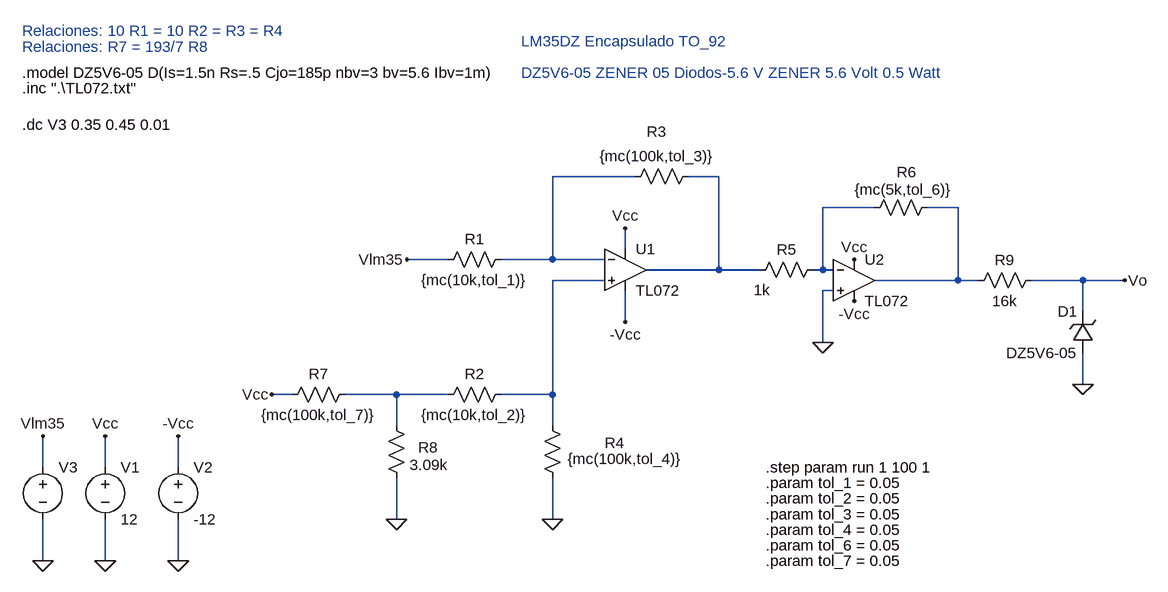
[diagram p0: schematic Modelo-2.asc]
Modelo-2.asc, the LTspice schematic file:
Version 4
SHEET 1 2448 680
WIRE 496 -208 368 -208
WIRE 624 -208 576 -208
WIRE 864 -160 784 -160
WIRE 992 -160 944 -160
WIRE 480 -96 480 -128
WIRE 208 -80 144 -80
WIRE 368 -80 368 -208
WIRE 368 -80 288 -80
WIRE 448 -80 368 -80
WIRE 624 -64 624 -208
WIRE 624 -64 512 -64
WIRE 688 -64 624 -64
WIRE 784 -64 784 -160
WIRE 784 -64 768 -64
WIRE 800 -64 784 -64
WIRE 448 -48 368 -48
WIRE 992 -48 992 -160
WIRE 992 -48 864 -48
WIRE 1024 -48 992 -48
WIRE 1184 -48 1104 -48
WIRE 1248 -48 1184 -48
WIRE 800 -32 784 -32
WIRE 1184 0 1184 -48
WIRE 480 16 480 -32
WIRE 784 48 784 -32
WIRE 1184 112 1184 64
WIRE -32 128 -64 128
WIRE 128 128 48 128
WIRE 208 128 128 128
WIRE 368 128 368 -48
WIRE 368 128 288 128
WIRE 128 176 128 128
WIRE 368 176 368 128
WIRE -416 240 -416 192
WIRE -320 240 -320 192
WIRE -208 240 -208 192
WIRE 128 320 128 256
WIRE 368 320 368 256
WIRE -416 384 -416 320
WIRE -320 384 -320 320
WIRE -208 384 -208 320
FLAG 368 320 0
FLAG 1248 -48 Vo
FLAG 480 -128 Vcc
FLAG 480 16 -Vcc
FLAG -208 192 -Vcc
FLAG -320 192 Vcc
FLAG -320 384 0
FLAG -208 384 0
FLAG -416 384 0
FLAG -416 192 Vlm35
FLAG 832 -80 Vcc
FLAG 832 -16 -Vcc
FLAG 1184 112 0
FLAG 144 -80 Vlm35
FLAG 784 48 0
FLAG 128 320 0
FLAG -64 128 Vcc
SYMBOL voltage -320 224 R0
WINDOW 123 0 0 Left 0
WINDOW 39 0 0 Left 0
SYMATTR InstName V1
SYMATTR Value 12
SYMBOL voltage -208 224 R0
WINDOW 123 0 0 Left 0
WINDOW 39 0 0 Left 0
SYMATTR InstName V2
SYMATTR Value -12
SYMBOL voltage -416 224 R0
WINDOW 123 0 0 Left 0
WINDOW 39 0 0 Left 0
WINDOW 3 24 44 Left 2
SYMATTR Value ""
SYMATTR InstName V3
SYMBOL Opamps\\opamp2 480 -128 R0
SYMATTR InstName U1
SYMATTR Value TL072
SYMBOL Opamps\\opamp2 832 -112 R0
SYMATTR InstName U2
SYMATTR Value TL072
SYMBOL res 1120 -64 R90
WINDOW 0 0 56 VBottom 2
WINDOW 3 32 56 VTop 2
SYMATTR InstName R9
SYMATTR Value 16k
SYMBOL zener 1200 64 R180
WINDOW 0 24 64 Left 2
WINDOW 3 24 0 Left 2
SYMATTR InstName D1
SYMATTR Value DZ5V6-05
SYMBOL res 304 -96 R90
WINDOW 0 0 56 VBottom 2
WINDOW 3 32 56 VTop 2
SYMATTR InstName R1
SYMATTR Value {mc(10k,tol_1)}
SYMBOL res 304 112 R90
WINDOW 0 0 56 VBottom 2
WINDOW 3 32 56 VTop 2
SYMATTR InstName R2
SYMATTR Value {mc(10k,tol_2)}
SYMBOL res 592 -224 R90
WINDOW 0 -37 64 VBottom 2
WINDOW 3 -31 63 VTop 2
SYMATTR InstName R3
SYMATTR Value {mc(100k,tol_3)}
SYMBOL res 384 272 R180
WINDOW 0 -95 70 Left 2
WINDOW 3 -184 45 Left 2
SYMATTR InstName R4
SYMATTR Value {mc(100k,tol_4)}
SYMBOL res 784 -80 R90
WINDOW 0 0 56 VBottom 2
WINDOW 3 31 94 VTop 2
SYMATTR InstName R5
SYMATTR Value 1k
SYMBOL res 960 -176 R90
WINDOW 0 -23 47 VBottom 2
WINDOW 3 -27 52 VTop 2
SYMATTR InstName R6
SYMATTR Value {mc(5k,tol_6)}
SYMBOL res 112 160 R0
WINDOW 0 49 49 Left 2
SYMATTR InstName R8
SYMATTR Value 3.09k
SYMBOL res 64 112 R90
WINDOW 0 0 56 VBottom 2
WINDOW 3 32 56 VTop 2
SYMATTR InstName R7
SYMATTR Value {mc(100k,tol_7)}
TEXT -448 -344 Left 2 !.inc ".\\TL072.txt"
TEXT -448 -288 Left 2 !.dc V3 0.35 0.45 0.01
TEXT -448 -368 Left 2 !.model DZ5V6-05 D(Is=1.5n Rs=.5 Cjo=185p nbv=3 bv=5.6 Ibv=1m)
TEXT 696 264 Left 2 !.param tol_1 = 0.05
TEXT 696 288 Left 2 !.param tol_2 = 0.05
TEXT 696 312 Left 2 !.param tol_3 = 0.05
TEXT 696 336 Left 2 !.param tol_4 = 0.05
TEXT 696 360 Left 2 !.param tol_6 = 0.05
TEXT 696 240 Left 2 !.step param run 1 100 1
TEXT -448 -432 Left 2 ;Relaciones: 10 R1 = 10 R2 = R3 = R4
TEXT -448 -408 Left 2 ;Relaciones: R7 = 193/7 R8
TEXT 320 -368 Left 2 ;DZ5V6-05 ZENER 05 Diodos-5.6 V ZENER 5.6 Volt 0.5 Watt
TEXT 320 -416 Left 2 ;LM35DZ Encapsulado TO_92
TEXT 696 384 Left 2 !.param tol_7 = 0.05

The netlist it stands for:
* Modelo-2.asc
V1 Vcc 0 12
V2 -Vcc 0 -12
V3 Vlm35 0
XU1 N005 N001 Vcc -Vcc N002 TL072  ; pins In+ In- V+ V- OUT
XU2 0 N003 Vcc -Vcc N004 TL072  ; pins In+ In- V+ V- OUT
R9 Vo N004 16k
D1 0 Vo DZ5V6-05
R1 N001 Vlm35 {mc(10k,tol_1)}
R2 N005 N006 {mc(10k,tol_2)}
R3 N002 N001 {mc(100k,tol_3)}
R4 0 N005 {mc(100k,tol_4)}
R5 N003 N002 1k
R6 N004 N003 {mc(5k,tol_6)}
R8 N006 0 3.09k
R7 N006 Vcc {mc(100k,tol_7)}
.model D D
.lib standard.dio
.inc ".\TL072.txt"
.dc V3 0.35 0.45 0.01
.model DZ5V6-05 D(Is=1.5n Rs=.5 Cjo=185p nbv=3 bv=5.6 Ibv=1m)
.param tol_1 = 0.05
.param tol_2 = 0.05
.param tol_3 = 0.05
.param tol_4 = 0.05
.param tol_6 = 0.05
.step param run 1 100 1
* Relaciones: 10 R1 = 10 R2 = R3 = R4
* Relaciones: R7 = 193/7 R8
* DZ5V6-05 ZENER 05 Diodos-5.6 V ZENER 5.6 Volt 0.5 Watt
* LM35DZ Encapsulado TO_92
.param tol_7 = 0.05
.backanno
.end